# EasyEDA Pro project Nibunkatsu_One_Rev1_Project.epro, board PCB1
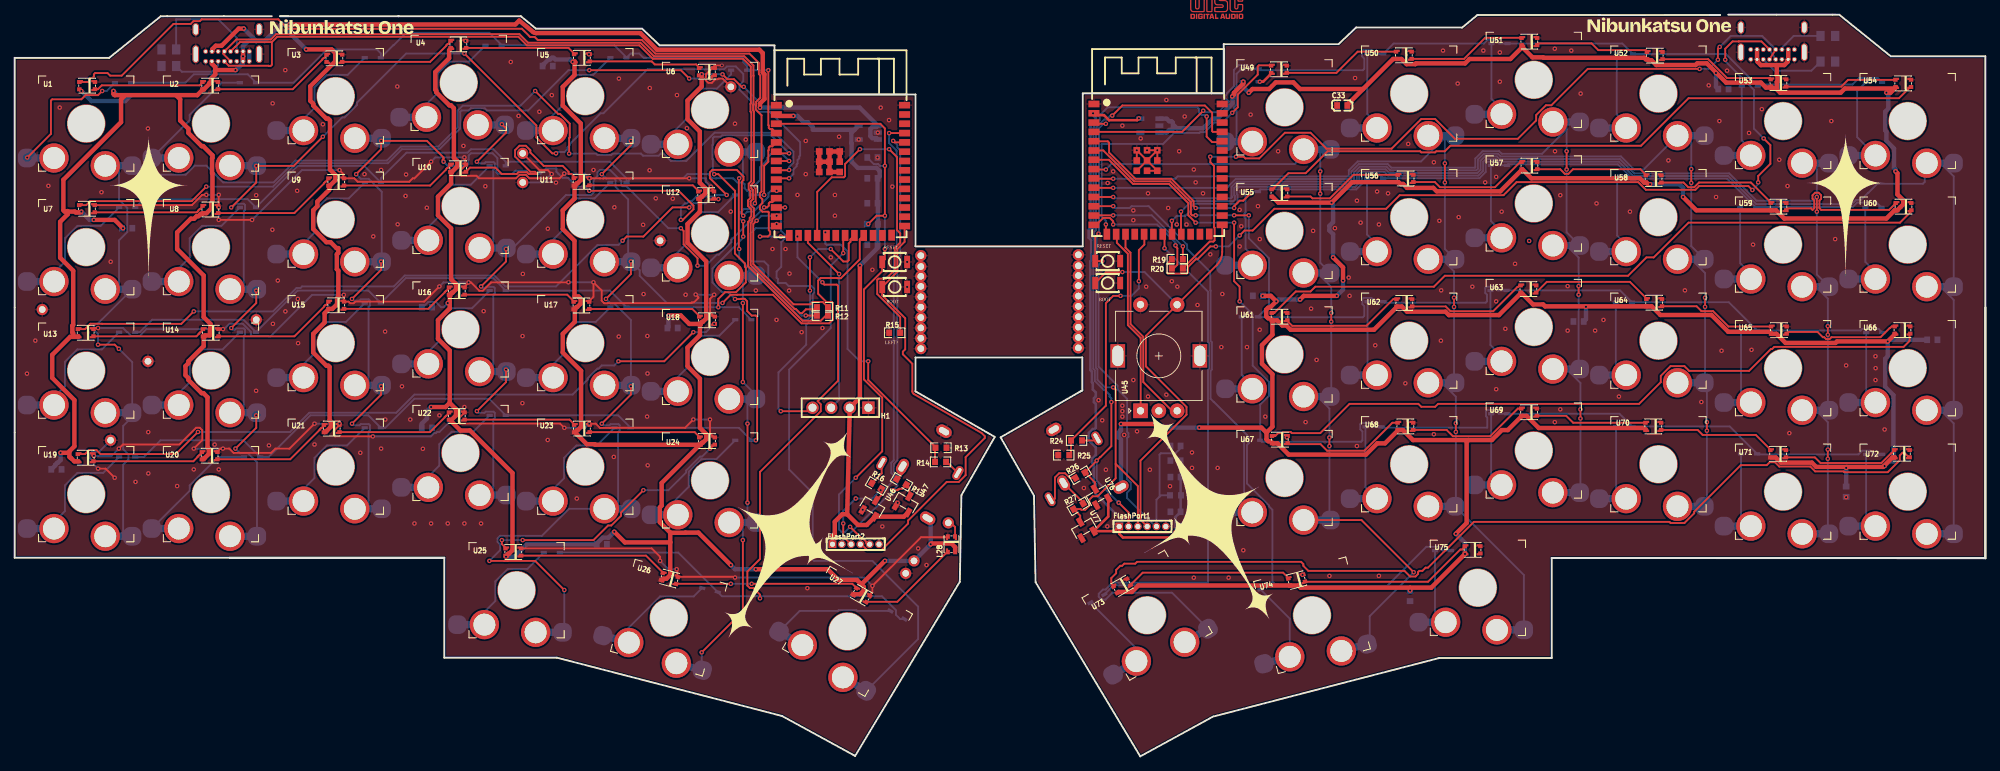
[diagram p1: board, top side]
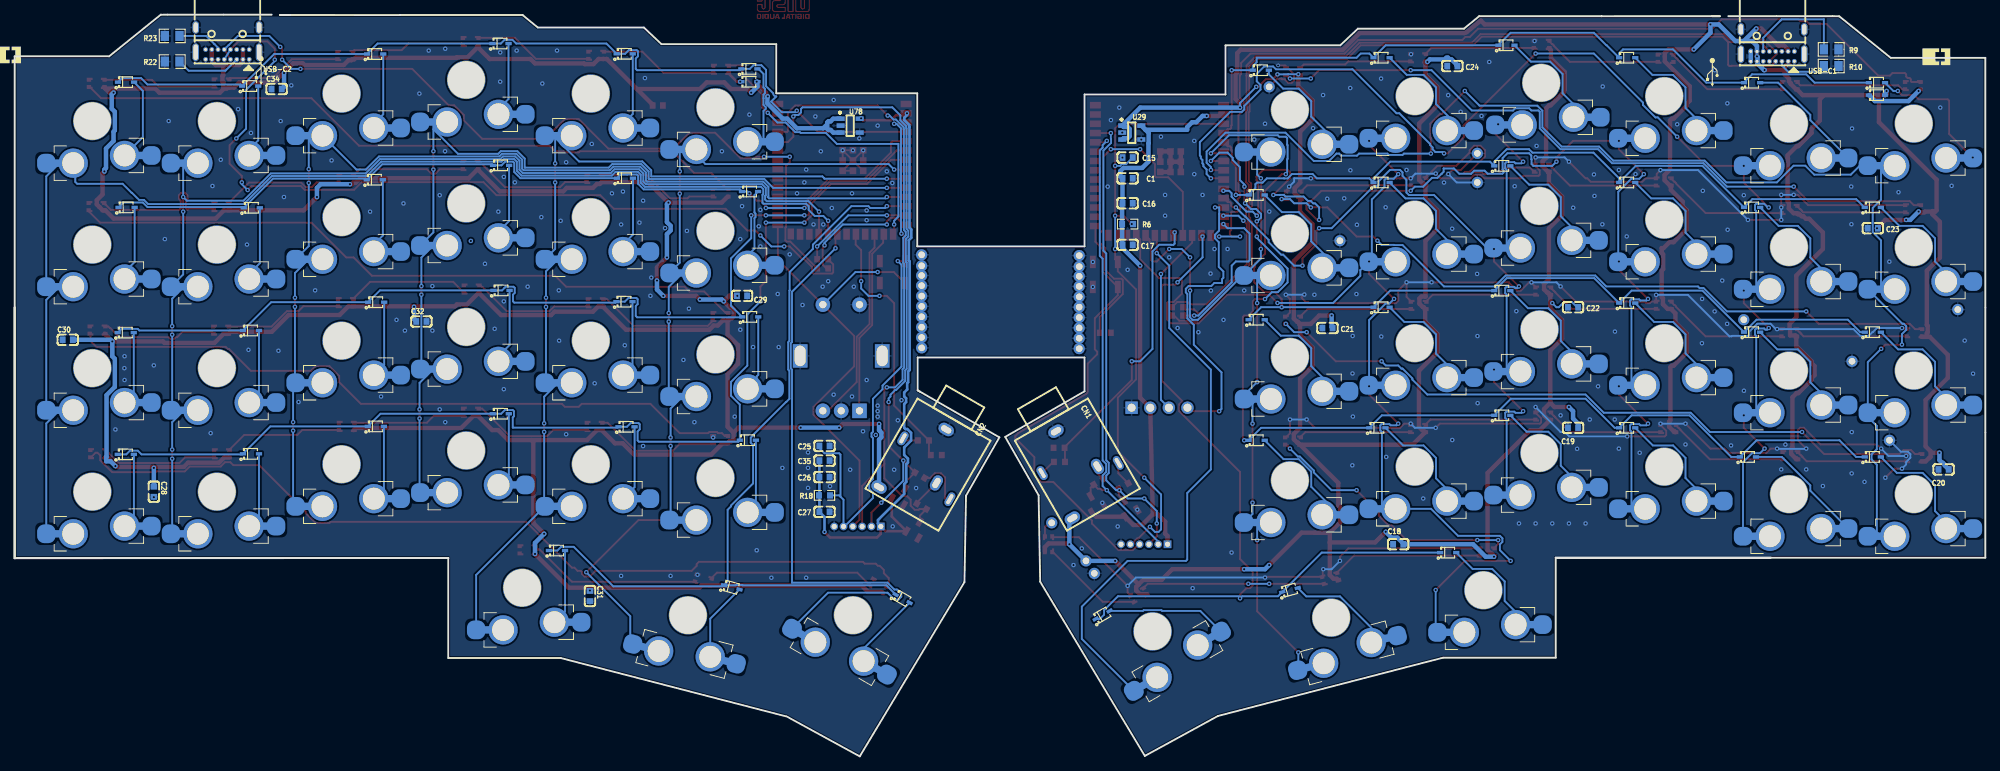
[diagram p2: board, bottom side, seen from below]

Outline 268.87 x 101.31 mm; copper layers: Top Layer, Bottom Layer. Coordinates in mm from the lower left corner of the outline.
Outline path: 58.62,27.13 0,27.13 0,95.41 12.9,95.41 19.93,101.08 20.83,101.1 35.07,101.1 ; 58.62,27.13 29.31,27.13 58.62,27.13 ; 58.62,27.13 58.62,13.48 73.98,13.48 104.7,5.51 114.67,0.06 128.95,23.86 129.17,35.67 133.72,43.63 122.9,49.86 122.9,54.48 145.67,54.48 145.67,50 ; 37.34,101.1 36.21,101.1 52.36,101.09 52.36,101.1 69.05,101.1 71.13,99.39 85.6,99.39 88.01,97.11 103.67,97.11 103.67,90.4 122.9,90.4 122.9,69.66 145.73,69.66 145.73,90.56 164.96,90.56 164.96,97.28 180.62,97.28 183.02,99.55 197.49,99.55 199.57,101.26 216.27,101.26 216.27,101.25 231.51,101.26 ; 145.67,50 134.52,43.57 139.07,35.61 139.29,23.8 153.57,0 163.54,5.45 ; 145.67,50 145.34,49.8 ; 163.63,5.47 194.35,13.43 209.71,13.43 209.71,27.09 ; 209.71,27.09 239.02,27.09 209.71,27.09 ; 209.71,27.09 268.33,27.09 ; 209.71,27.09 268.33,27.09 ; 209.71,27.09 268.87,27.07 ; 268.33,27.09 268.87,27.07 ; 231.28,101.26 231.51,101.26 ; 231.51,101.26 232.68,101.26 232.42,101.26 231.51,101.26 ; 233.8,101.31 248.04,101.31 248.94,101.3 255.97,95.62 268.87,95.62 268.87,27.07 ; 268.87,27.07 268.87,61.34 268.87,27.07
Stack: Top Layer 0.035mm / Dielectric1 1.51mm FR4 er 4.5 / Bottom Layer 0.035mm

## Design rules (mm)
template: JLCPCB Capability(Two Layers Board)
spacing copperThickness1oz (default): track to track 0.102, other pairs 0.152 to 0.3
spacing copperThickness2oz: track to track 0.203, other pairs 0.152 to 0.3
track width copperThickness1oz (default): min 0.127, default 0.254, max 2.54
track width copperThickness2oz: min 0.203, default 0.254, max 2.54
differential pair differentialPair (default): width min 0.127, default 0.254, max 2.54; gap min 0.152, default 0.152
via viaSize (default): diameter min 0.5, default 0.61, max 10; hole min 0.3, default 0.305, max 6.3

## Placement (name value [footprint] x y rotation side)
C1  1nF  [C0603]  117.02 78.95 180 bottom
C15  1uF  [C0603]  117.02 81.79 180 bottom
C16  0.1uF  [C0603]  117.02 75.55 180 bottom
C17  22uF  [C0603]  117.02 69.87 180 bottom
C18  10uF  [C0603]  80.1 28.97 0 bottom
C19  100nF  [C0603]  56.25 44.87 180 bottom
C20  100nF  [C0603]  5.7 39.19 180 bottom
C21  100nF  [C0603]  89.76 58.51 0 bottom
C22  100nF  [C0603]  56.25 61.35 0 bottom
C23  100nF  [C0603]  15.35 72.14 180 bottom
C24  10uF  [C0603]  72.72 94.29 180 bottom
C25  1uF  [C0603]  158.38 42.4 0 bottom
C26  0.1uF  [C0603]  158.38 38.15 180 bottom
C27  22uF  [C0603]  158.38 33.4 180 bottom
C28  10uF  [C0603]  249.88 36.15 270 bottom
C29  100nF  [C0603]  169.63 62.9 0 bottom
C30  100nF  [C0603]  261.63 56.9 180 bottom
C31  100nF  [C0603]  190.38 21.9 270 bottom
C32  100nF  [C0603]  213.38 59.4 180 bottom
C33  100nF  [C0603]  181.13 88.9 0 top
C34  10uF  [C0603]  233.13 91.15 180 bottom
C35  1nF  [C0603]  158.38 40.4 180 bottom
CN1  PJ-324M  [AUDIO-TH_PJ-324M#2]  123.64 39.65 240 bottom
CN2  PJ-324M  [AUDIO-TH_PJ-324M]  144.32 39.54 300 bottom
D1  1N4148WS  [SOD-323_L1.7-W1.3-LS2.7-RD]  14.78 92.02 180 bottom
D2  1N4148WS  [SOD-323_L1.7-W1.3-LS2.7-RD]  31.82 92.02 180 bottom
D3  1N4148WS  [SOD-323_L1.7-W1.3-LS2.7-RD]  48.86 95.43 180 bottom
D4  1N4148WS  [SOD-323_L1.7-W1.3-LS2.7-RD]  65.34 97.13 180 bottom
D5  1N4148WS  [SOD-323_L1.7-W1.3-LS2.7-RD]  82.38 95.43 180 bottom
D6  1N4148WS  [SOD-323_L1.7-W1.3-LS2.7-RD]  98.85 93.72 180 bottom
D7  1N4148WS  [SOD-323_L1.7-W1.3-LS2.7-RD]  15.35 74.98 180 bottom
D8  1N4148WS  [SOD-323_L1.7-W1.3-LS2.7-RD]  31.82 74.98 180 bottom
D9  1N4148WS  [SOD-323_L1.7-W1.3-LS2.7-RD]  48.86 78.39 180 bottom
D10  1N4148WS  [SOD-323_L1.7-W1.3-LS2.7-RD]  65.9 80.66 180 bottom
D11  1N4148WS  [SOD-323_L1.7-W1.3-LS2.7-RD]  82.38 78.39 180 bottom
D12  1N4148WS  [SOD-323_L1.7-W1.3-LS2.7-RD]  99.42 76.68 180 bottom
D13  1N4148WS  [SOD-323_L1.7-W1.3-LS2.7-RD]  15.35 57.94 180 bottom
D14  1N4148WS  [SOD-323_L1.7-W1.3-LS2.7-RD]  31.82 57.94 180 bottom
D15  1N4148WS  [SOD-323_L1.7-W1.3-LS2.7-RD]  48.86 61.91 180 bottom
D16  1N4148WS  [SOD-323_L1.7-W1.3-LS2.7-RD]  65.9 63.62 180 bottom
D17  1N4148WS  [SOD-323_L1.7-W1.3-LS2.7-RD]  82.38 61.35 180 bottom
D18  1N4148WS  [SOD-323_L1.7-W1.3-LS2.7-RD]  99.42 59.64 180 bottom
D19  1N4148WS  [SOD-323_L1.7-W1.3-LS2.7-RD]  15.35 40.9 180 bottom
D20  1N4148WS  [SOD-323_L1.7-W1.3-LS2.7-RD]  32.39 40.9 180 bottom
D21  1N4148WS  [SOD-323_L1.7-W1.3-LS2.7-RD]  48.86 44.87 180 bottom
D22  1N4148WS  [SOD-323_L1.7-W1.3-LS2.7-RD]  65.9 46.58 180 bottom
D23  1N4148WS  [SOD-323_L1.7-W1.3-LS2.7-RD]  82.94 44.87 180 bottom
D24  1N4148WS  [SOD-323_L1.7-W1.3-LS2.7-RD]  99.42 43.17 180 bottom
D25  1N4148WS  [SOD-323_L1.7-W1.3-LS2.7-RD]  73.29 27.83 180 bottom
D26  1N4148WS  [SOD-323_L1.7-W1.3-LS2.7-RD]  94.87 22.72 165 bottom
D27  1N4148WS  [SOD-323_L1.7-W1.3-LS2.7-RD]  120.43 19.31 150 bottom
D28  1N4148WS  [SOD-323_L1.7-W1.3-LS2.7-RD]  14.78 90.31 180 bottom
D29  1N4148WS  [SOD-323_L1.7-W1.3-LS2.7-RD]  168.63 93.9 180 bottom
D30  1N4148WS  [SOD-323_L1.7-W1.3-LS2.7-RD]  185.63 95.96 180 bottom
D31  1N4148WS  [SOD-323_L1.7-W1.3-LS2.7-RD]  202.59 97.36 180 bottom
D32  1N4148WS  [SOD-323_L1.7-W1.3-LS2.7-RD]  219.68 95.93 180 bottom
D33  1N4148WS  [SOD-323_L1.7-W1.3-LS2.7-RD]  236.74 91.55 180 bottom
D34  1N4148WS  [SOD-323_L1.7-W1.3-LS2.7-RD]  253.68 92.09 180 bottom
D35  1N4148WS  [SOD-323_L1.7-W1.3-LS2.7-RD]  168.54 77.15 180 bottom
D36  1N4148WS  [SOD-323_L1.7-W1.3-LS2.7-RD]  185.61 78.97 180 bottom
D37  1N4148WS  [SOD-323_L1.7-W1.3-LS2.7-RD]  202.51 80.72 180 bottom
D38  1N4148WS  [SOD-323_L1.7-W1.3-LS2.7-RD]  219.73 78.76 180 bottom
D39  1N4148WS  [SOD-323_L1.7-W1.3-LS2.7-RD]  236.52 74.93 180 bottom
D40  1N4148WS  [SOD-323_L1.7-W1.3-LS2.7-RD]  253.6 74.98 180 bottom
D41  1N4148WS  [SOD-323_L1.7-W1.3-LS2.7-RD]  168.51 60.03 180 bottom
D42  1N4148WS  [SOD-323_L1.7-W1.3-LS2.7-RD]  185.67 62.11 180 bottom
D43  1N4148WS  [SOD-323_L1.7-W1.3-LS2.7-RD]  202.44 63.64 180 bottom
D44  1N4148WS  [SOD-323_L1.7-W1.3-LS2.7-RD]  219.55 62.03 180 bottom
D45  1N4148WS  [SOD-323_L1.7-W1.3-LS2.7-RD]  236.63 58.17 180 bottom
D46  1N4148WS  [SOD-323_L1.7-W1.3-LS2.7-RD]  253.71 57.88 180 bottom
D47  1N4148WS  [SOD-323_L1.7-W1.3-LS2.7-RD]  168.84 43.18 180 bottom
D48  1N4148WS  [SOD-323_L1.7-W1.3-LS2.7-RD]  185.39 45.01 180 bottom
D49  1N4148WS  [SOD-323_L1.7-W1.3-LS2.7-RD]  202.55 46.79 180 bottom
D50  1N4148WS  [SOD-323_L1.7-W1.3-LS2.7-RD]  219.59 45.07 180 bottom
D51  1N4148WS  [SOD-323_L1.7-W1.3-LS2.7-RD]  236.63 41.32 180 bottom
D52  1N4148WS  [SOD-323_L1.7-W1.3-LS2.7-RD]  253.7 41.24 180 bottom
D53  1N4148WS  [SOD-323_L1.7-W1.3-LS2.7-RD]  147.71 21.55 210 bottom
D54  1N4148WS  [SOD-323_L1.7-W1.3-LS2.7-RD]  171.04 23.08 195 bottom
D55  1N4148WS  [SOD-323_L1.7-W1.3-LS2.7-RD]  194.88 28.11 180 bottom
D56  1N4148WS  [SOD-323_L1.7-W1.3-LS2.7-RD]  168.63 92.15 180 bottom
FlashPort1  HX PZ1.27-1x6P WZ  [HDR-TH_6P_HXPZ1.27-1X6PWZ]  153.88 31.4 0 top
FlashPort2  HX PZ1.27-1x6P WZ  [HDR-TH_6P_HXPZ1.27-1X6PWZ]  114.75 28.97 0 top
H1  2.54-1*4P母  [HDR-TH_4P-P2.54-V-F]  112.67 47.62 180 top
L1  WS2812C-2020  [LED-SMD_L2.2-W2.0]  9.89 91.61 0 top
L2  WS2812C-2020  [LED-SMD_L2.2-W2.0]  26.68 91.61 0 top
L3  WS2812C-2020  [LED-SMD_L2.2-W2.0]  43.62 95.34 0 top
L4  WS2812C-2020  [LED-SMD_L2.2-W2.0]  60.54 97.25 0 top
L5  WS2812C-2020  [LED-SMD_L2.2-W2.0]  77.39 95.41 0 top
L6  WS2812C-2020  [LED-SMD_L2.2-W2.0]  94.45 93.51 0 top
L7  WS2812C-2020  [LED-SMD_L2.2-W2.0]  9.86 74.79 0 top
L8  WS2812C-2020  [LED-SMD_L2.2-W2.0]  26.7 74.69 0 top
L9  WS2812C-2020  [LED-SMD_L2.2-W2.0]  43.87 78.45 0 top
L10  WS2812C-2020  [LED-SMD_L2.2-W2.0]  60.51 80.33 0 top
L11  WS2812C-2020  [LED-SMD_L2.2-W2.0]  77.35 78.48 0 top
L12  WS2812C-2020  [LED-SMD_L2.2-W2.0]  94.34 76.65 0 top
L13  WS2812C-2020  [LED-SMD_L2.2-W2.0]  9.69 57.86 0 top
L14  WS2812C-2020  [LED-SMD_L2.2-W2.0]  26.75 57.86 0 top
L15  WS2812C-2020  [LED-SMD_L2.2-W2.0]  43.87 61.61 0 top
L16  WS2812C-2020  [LED-SMD_L2.2-W2.0]  60.32 63.55 0 top
L17  WS2812C-2020  [LED-SMD_L2.2-W2.0]  77.33 61.59 0 top
L18  WS2812C-2020  [LED-SMD_L2.2-W2.0]  94.46 59.56 0 top
L19  WS2812C-2020  [LED-SMD_L2.2-W2.0]  9.69 40.79 0 top
L20  WS2812C-2020  [LED-SMD_L2.2-W2.0]  26.6 41.06 0 top
L21  WS2812C-2020  [LED-SMD_L2.2-W2.0]  43.25 44.77 0 top
L22  WS2812C-2020  [LED-SMD_L2.2-W2.0]  60.32 46.48 0 top
L23  WS2812C-2020  [LED-SMD_L2.2-W2.0]  77.39 44.77 0 top
L24  WS2812C-2020  [LED-SMD_L2.2-W2.0]  94.46 43.06 0 top
L25  WS2812C-2020  [LED-SMD_L2.2-W2.0]  68.03 27.9 0 top
L26  WS2812C-2020  [LED-SMD_L2.2-W2.0]  89.34 24.29 345 top
L27  WS2812C-2020  [LED-SMD_L2.2-W2.0]  115.51 22.01 330 top
L28  WS2812C-2020  [LED-SMD_L2.2-W2.0]  127.82 28.97 90 top
L29  WS2812C-2020  [LED-SMD_L2.2-W2.0]  172.49 93.84 0 top
L30  WS2812C-2020  [LED-SMD_L2.2-W2.0]  189.53 95.75 0 top
L31  WS2812C-2020  [LED-SMD_L2.2-W2.0]  206.66 97.62 0 top
L32  WS2812C-2020  [LED-SMD_L2.2-W2.0]  223.76 95.71 0 top
L33  WS2812C-2020  [LED-SMD_L2.2-W2.0]  240.64 91.97 0 top
L34  WS2812C-2020  [LED-SMD_L2.2-W2.0]  257.67 91.92 0 top
L35  WS2812C-2020  [LED-SMD_L2.2-W2.0]  172.56 76.95 0 top
L36  WS2812C-2020  [LED-SMD_L2.2-W2.0]  189.77 78.93 0 top
L37  WS2812C-2020  [LED-SMD_L2.2-W2.0]  206.67 80.68 0 top
L38  WS2812C-2020  [LED-SMD_L2.2-W2.0]  223.61 78.86 0 top
L39  WS2812C-2020  [LED-SMD_L2.2-W2.0]  240.65 75.08 0 top
L40  WS2812C-2020  [LED-SMD_L2.2-W2.0]  257.7 75.08 0 top
L41  WS2812C-2020  [LED-SMD_L2.2-W2.0]  172.57 60.05 0 top
L42  WS2812C-2020  [LED-SMD_L2.2-W2.0]  189.6 61.94 0 top
L43  WS2812C-2020  [LED-SMD_L2.2-W2.0]  206.53 63.82 0 top
L44  WS2812C-2020  [LED-SMD_L2.2-W2.0]  223.68 61.97 0 top
L45  WS2812C-2020  [LED-SMD_L2.2-W2.0]  240.7 58.21 0 top
L46  WS2812C-2020  [LED-SMD_L2.2-W2.0]  257.56 58.22 0 top
L47  WS2812C-2020  [LED-SMD_L2.2-W2.0]  172.61 43.26 0 top
L48  WS2812C-2020  [LED-SMD_L2.2-W2.0]  189.74 45.07 0 top
L49  WS2812C-2020  [LED-SMD_L2.2-W2.0]  206.62 47 0 top
L50  WS2812C-2020  [LED-SMD_L2.2-W2.0]  223.57 45.07 0 top
L51  WS2812C-2020  [LED-SMD_L2.2-W2.0]  240.6 41.32 0 top
L52  WS2812C-2020  [LED-SMD_L2.2-W2.0]  257.48 41.33 0 top
L53  WS2812C-2020  [LED-SMD_L2.2-W2.0]  151.08 23.28 30 top
L54  WS2812C-2020  [LED-SMD_L2.2-W2.0]  174.91 24.07 15 top
L55  WS2812C-2020  [LED-SMD_L2.2-W2.0]  198.91 28.2 0 top
NOREF  -  [Pad_e20794]  123.63 64.19 0 top
NOREF#2  -  [Pad_e21819]  145.13 60.04 0 top
NOREF#3  -  [Pad_e21814]  145.13 65.68 0 top
NOREF#4  -  [Pad_e21817]  145.13 61.47 0 top
NOREF#5  -  [Pad_e20797]  123.63 61.36 0 top
NOREF#6  -  [Pad_e21821]  145.13 55.79 0 top
NOREF#7  -  [Pad_e6608]  97.71 91.45 0 top
NOREF#8  -  [Pad_e20799]  123.63 58.52 0 top
NOREF#9  -  [Pad_e6609]  3.76 61.03 0 top
NOREF#10  -  [Pad_e20798]  123.63 59.94 0 top
NOREF#11  -  [Pad_e21815]  145.13 64.29 0 top
NOREF#12  -  [Pad_e21812]  145.13 68.5 0 top
NOREF#13  -  [Pad_e14164]  127.38 31.9 0 top
NOREF#14  -  [Pad_e21820]  145.13 57.22 0 top
NOREF#15  -  [Pad_e4008]  13.08 43.17 0 top
NOREF#16  -  [Pad_e7011]  32.96 59.64 0 top
NOREF#17  -  [Pad_e19134]  123.63 65.57 0 top
NOREF#18  -  [Pad_e4802]  18.19 53.96 0 top
NOREF#19  -  [Pad_e20806]  123.63 55.69 0 top
NOREF#20  -  [Pad_e5564]  88.06 70.43 0 top
NOREF#21  -  [Pad_e21816]  145.13 62.87 0 top
NOREF#22  -  [Pad_e20801]  123.63 57.11 0 top
NOREF#23  -  [Pad_e14163]  121.57 24.99 0 top
NOREF#24  -  [Pad_e5862]  69.31 82.36 0 top
NOREF#25  -  [Pad_e6602]  69.31 78.39 0 top
NOREF#26  -  [Pad_e19126]  123.63 68.4 0 top
NOREF#27  -  [Pad_e21813]  145.13 67 0 top
NOREF#28  -  [Pad_e14165]  122.7 26.7 0 top
NOREF#29  -  [Pad_e19133]  123.63 66.9 0 top
NOREF#30  -  [Pad_e21818]  145.13 58.62 0 top
NOREF#31  -  [Pad_e20795]  123.63 62.77 0 top
R6  10K  [R0603]  117.02 72.71 0 bottom
R9  5.1kΩ  [R0805]  21.03 96.56 180 bottom
R10  5.1kΩ  [R0805]  21.03 94.29 180 bottom
R11  0K  [R0603]  110.21 61.35 0 top
R12  0K  [R0603]  110.21 60.21 180 top
R13  10K  [R0603]  126.38 42.15 180 top
R14  5.1K  [R0603]  126.32 40.22 0 top
R15  0K  [R0603]  120.06 57.86 0 top
R16  22  [R0603]  117.59 36.92 330 top
R17  22  [R0603]  121 37.49 150 top
R18  10K  [R0603]  158.38 35.65 0 bottom
R19  0K  [R0603]  158.63 67.9 0 top
R20  0K  [R0603]  158.63 66.65 180 top
R22  5.1kΩ  [R0805]  247.38 94.9 0 bottom
R23  5.1kΩ  [R0805]  247.38 98.4 0 bottom
R24  5.1K  [R0603]  144.88 43.15 0 top
R25  10K  [R0603]  143.13 41.15 0 top
R26  22  [R0603]  145.38 38.4 30 top
R27  22  [R0603]  145.13 34.15 30 top
SW1  B3U-1000P  [KEY-SMD_B3U-1000PM]  120.06 67.53 0 top
SW2  B3U-1000P  [KEY-SMD_B3U-1000PM]  120.06 64.12 180 top
SW3  B3U-1000P  [KEY-SMD_B3U-1000PM]  149.13 67.65 0 top
SW4  B3U-1000P  [KEY-SMD_B3U-1000PM]  149.13 64.65 180 top
U1  -  [SW_Gateron_LowProfile_HotSwap_PTH1]  9.76 86.43 0 top
U2  -  [SW_Gateron_LowProfile_HotSwap_PTH1]  26.79 86.43 0 top
U3  -  [SW_Gateron_LowProfile_HotSwap_PTH1]  43.81 90.18 0 top
U4  -  [SW_Gateron_LowProfile_HotSwap_PTH1]  60.59 91.99 0 top
U5  -  [SW_Gateron_LowProfile_HotSwap_PTH1]  77.85 90.18 0 top
U6  -  [SW_Gateron_LowProfile_HotSwap_PTH1]  94.88 88.3 0 top
U7  -  [SW_Gateron_LowProfile_HotSwap_PTH1]  9.76 69.56 0 top
U8  -  [SW_Gateron_LowProfile_HotSwap_PTH1]  26.79 69.56 0 top
U9  -  [SW_Gateron_LowProfile_HotSwap_PTH1]  43.81 73.3 0 top
U10  -  [SW_Gateron_LowProfile_HotSwap_PTH1]  60.83 75.18 0 top
U11  -  [SW_Gateron_LowProfile_HotSwap_PTH1]  77.85 73.3 0 top
U12  -  [SW_Gateron_LowProfile_HotSwap_PTH1]  94.88 71.43 0 top
U13  -  [SW_Gateron_LowProfile_HotSwap_PTH1]  9.76 52.69 0 top
U14  -  [SW_Gateron_LowProfile_HotSwap_PTH1]  26.79 52.69 0 top
U15  -  [SW_Gateron_LowProfile_HotSwap_PTH1]  43.81 56.43 0 top
U16  -  [SW_Gateron_LowProfile_HotSwap_PTH1]  60.83 58.31 0 top
U17  -  [SW_Gateron_LowProfile_HotSwap_PTH1]  77.85 56.43 0 top
U18  -  [SW_Gateron_LowProfile_HotSwap_PTH1]  94.88 54.56 0 top
U19  -  [SW_Gateron_LowProfile_HotSwap_PTH1]  9.76 35.81 0 top
U20  -  [SW_Gateron_LowProfile_HotSwap_PTH1]  26.79 35.81 0 top
U21  -  [SW_Gateron_LowProfile_HotSwap_PTH1]  43.81 39.56 0 top
U22  -  [SW_Gateron_LowProfile_HotSwap_PTH1]  60.83 41.44 0 top
U23  -  [SW_Gateron_LowProfile_HotSwap_PTH1]  77.85 39.56 0 top
U24  -  [SW_Gateron_LowProfile_HotSwap_PTH1]  94.88 37.69 0 top
U25  -  [SW_Gateron_LowProfile_HotSwap_PTH1]  68.48 22.69 0 top
U26  -  [SW_Gateron_LowProfile_HotSwap_PTH1#2]  89.25 18.94 345 top
U27  -  [SW_Gateron_LowProfile_HotSwap_PTH1]  113.62 17.07 330 top
U29  AP2112K-3.3TRG1  [SOT-25-5_L2.9-W1.6-P0.95-LS2.8-BL]  116.46 85.2 270 bottom
U30  ESP32-S3-WROOM-1-N4R2  [WIRELM-SMD_ESP32-S3-WROOM-1]  112.67 80.05 0 top
U45  -  [RotaryEncoder_Alps_EC11E-Switch_Vertical_H20mm]  153.6 47.2 90 top
U46  BAT54S  [SOT-23-3_L2.9-W1.3-P1.90-LS2.4-BR]  117.02 34.08 240 top
U47  BAT54S  [SOT-23-3_L2.9-W1.3-P1.90-LS2.4-BR]  121.57 34.65 240 top
U48  ESP32-S3-WROOM-1-N4R2  [WIRELM-SMD_ESP32-S3-WROOM-1]  156 80.21 0 top
U49  -  [SW_Gateron_LowProfile_HotSwap_PTH1]  173.25 88.65 0 top
U50  -  [SW_Gateron_LowProfile_HotSwap_PTH1]  190.26 90.52 0 top
U51  -  [SW_Gateron_LowProfile_HotSwap_PTH1]  207.26 92.4 0 top
U52  -  [SW_Gateron_LowProfile_HotSwap_PTH1]  224.27 90.52 0 top
U53  -  [SW_Gateron_LowProfile_HotSwap_PTH1]  241.27 86.77 0 top
U54  -  [SW_Gateron_LowProfile_HotSwap_PTH1]  258.28 86.77 0 top
U55  -  [SW_Gateron_LowProfile_HotSwap_PTH1]  173.25 71.77 0 top
U56  -  [SW_Gateron_LowProfile_HotSwap_PTH1]  190.26 73.65 0 top
U57  -  [SW_Gateron_LowProfile_HotSwap_PTH1]  207.26 75.52 0 top
U58  -  [SW_Gateron_LowProfile_HotSwap_PTH1]  224.27 73.65 0 top
U59  -  [SW_Gateron_LowProfile_HotSwap_PTH1]  241.27 69.9 0 top
U60  -  [SW_Gateron_LowProfile_HotSwap_PTH1]  258.28 69.9 0 top
U61  -  [SW_Gateron_LowProfile_HotSwap_PTH1]  173.25 54.9 0 top
U62  -  [SW_Gateron_LowProfile_HotSwap_PTH1]  190.26 56.77 0 top
U63  -  [SW_Gateron_LowProfile_HotSwap_PTH1]  207.26 58.65 0 top
U64  -  [SW_Gateron_LowProfile_HotSwap_PTH1]  224.27 56.77 0 top
U65  -  [SW_Gateron_LowProfile_HotSwap_PTH1]  241.27 53.02 0 top
U66  -  [SW_Gateron_LowProfile_HotSwap_PTH1]  258.28 53.02 0 top
U67  -  [SW_Gateron_LowProfile_HotSwap_PTH1]  173.25 38.02 0 top
U68  -  [SW_Gateron_LowProfile_HotSwap_PTH1]  190.26 39.9 0 top
U69  -  [SW_Gateron_LowProfile_HotSwap_PTH1]  207.26 41.77 0 top
U70  -  [SW_Gateron_LowProfile_HotSwap_PTH1]  224.27 39.9 0 top
U71  -  [SW_Gateron_LowProfile_HotSwap_PTH1]  241.27 36.15 0 top
U72  -  [SW_Gateron_LowProfile_HotSwap_PTH1]  258.28 36.15 0 top
U73  -  [SW_Gateron_LowProfile_HotSwap_PTH1]  154.5 19.27 30 top
U74  -  [SW_Gateron_LowProfile_HotSwap_PTH1]  177 19.27 15 top
U75  -  [SW_Gateron_LowProfile_HotSwap_PTH1]  199.63 23.02 0 top
U76  BAT54S  [SOT-23-3_L2.9-W1.3-P1.90-LS2.4-BR]  147.88 35.65 300 top
U77  BAT54S  [SOT-23-3_L2.9-W1.3-P1.90-LS2.4-BR]  145.88 31.15 300 top
U78  AP2112K-3.3TRG1  [SOT-25-5_L2.9-W1.6-P0.95-LS2.8-BL]  154.88 86.15 270 bottom
USB-C1  USB4085-GF-A  [USC-C-SMD_USB4085-GF-A]  29.03 97.11 0 bottom
USB-C2  USB4085-GF-A  [USC-C-SMD_USB4085-GF-A]  239.84 97.38 0 bottom

## Footprints (pads in the part's own frame, mm; a bottom-side part is the same pattern mirrored in y, then rotated)
AUDIO-TH_PJ-324M
  oval 1.5x2.2 hole 0.8x1.5: 1(-5.7,-0.35) 4(5.7,-4.35)
  oval 2x1 hole 1.5x0.5: 2(2.3,4.85)
  oval 2.2x1.4 hole 1.5x0.8: 3(1.3,2.15)
  oval 2x1.1 hole 1.5x0.5: 5(-1.7,-4.85)
AUDIO-TH_PJ-324M#2
  oval 1.5x2.2 hole 0.8x1.5: 1(-5.7,-0.35) 4(5.7,-4.35)
  oval 2x1 hole 1.5x0.5: 2(2.3,4.85)
  oval 2.2x1.4 hole 1.5x0.8: 3(1.3,2.15)
  oval 2x1.1 hole 1.5x0.5: 5(-1.7,-4.85)
C0603
  rect 0.8x0.9 smd: 1(-0.7,0) 2(0.7,0)
HDR-TH_4P-P2.54-V-F
  rect 1.7x1.7 hole 1.1: 1(-3.81,0)
  round 1.7 hole 1.1: 2(-1.27,0) 3(1.27,0) 4(3.81,0)
HDR-TH_6P_HXPZ1.27-1X6PWZ
  rect 1.05x1.05 hole 0.7: 1(-3.175,0)
  round 1.05 hole 0.7: 2(-1.905,0) 3(-0.635,0) 4(0.635,0) 5(1.905,0) 6(3.175,0)
KEY-SMD_B3U-1000PM
  rect 0.8x1.7 smd: 1(-1.7,0) 2(1.7,0)
LED-SMD_L2.2-W2.0
  custom 0.8x0.536 smd: 1(0.965,-0.485) 3(-0.966,0.5)
  custom 0.802x0.535 smd: 2(0.965,0.5)
  custom 0.8x0.535 smd: 4(-0.966,-0.5)
Pad_e4008
  round 1.524 hole 0.914: 6(0,0)
Pad_e4802
  round 1.524 hole 0.914: 1(0,0)
Pad_e5564
  round 1.524 hole 0.914: 3(0,0)
Pad_e5862
  round 1.524 hole 0.914: 1(0,0)
Pad_e6602
  round 1.524 hole 0.914: 3(0,0)
Pad_e6608
  round 1.524 hole 0.914: 9(0,0)
Pad_e6609
  round 1.524 hole 0.914: 10(0,0)
Pad_e7011
  round 1.524 hole 0.914: 3(0,0)
Pad_e14163
  round 1.524 hole 0.914: 8(0,0)
Pad_e14164
  round 1.524 hole 0.914: 8(0,0)
Pad_e14165
  round 1.524 hole 0.914: 8(0,0)
Pad_e19126
  round 1.524 hole 0.914: 8(0,0)
Pad_e19133
  round 1.524 hole 0.914: 8(0,0)
Pad_e19134
  round 1.524 hole 0.914: 8(0,0)
Pad_e20794
  round 1.524 hole 0.914: 8(0,0)
Pad_e20795
  round 1.524 hole 0.914: 8(0,0)
Pad_e20797
  round 1.524 hole 0.914: 8(0,0)
Pad_e20798
  round 1.524 hole 0.914: 8(0,0)
Pad_e20799
  round 1.524 hole 0.914: 8(0,0)
Pad_e20801
  round 1.524 hole 0.914: 8(0,0)
Pad_e20806
  round 1.524 hole 0.914: 8(0,0)
Pad_e21812
  round 1.524 hole 0.914: 8(0,0)
Pad_e21813
  round 1.524 hole 0.914: 8(0,0)
Pad_e21814
  round 1.524 hole 0.914: 8(0,0)
Pad_e21815
  round 1.524 hole 0.914: 8(0,0)
Pad_e21816
  round 1.524 hole 0.914: 8(0,0)
Pad_e21817
  round 1.524 hole 0.914: 8(0,0)
Pad_e21818
  round 1.524 hole 0.914: 8(0,0)
Pad_e21819
  round 1.524 hole 0.914: 8(0,0)
Pad_e21820
  round 1.524 hole 0.914: 8(0,0)
Pad_e21821
  round 1.524 hole 0.914: 8(0,0)
R0603
  rect 0.806x0.864 smd: 1(-0.753,0) 2(0.753,0)
R0805
  rect 1.133x1.377 smd: 1(-1,0) 2(1,0)
RotaryEncoder_Alps_EC11E-Switch_Vertical_H20mm
  rect 2x2 hole 1: A(0,0)
  round 2 hole 1: B(0,-5) C(0,-2.5) S1(14.5,-5) S2(14.5,0)
  rect 3.2x2 hole 2.8x1.5: MT1(7.5,3.1) MT2(7.5,-8.1)
SOD-323_L1.7-W1.3-LS2.7-RD
  rect 0.845x0.455 smd: 1(-1.097,0) 2(1.097,0)
SOT-23-3_L2.9-W1.3-P1.90-LS2.4-BR
  rect 1.25x0.7 smd: 1(1,-0.95) 2(1,0.95) 3(-1,0)
SOT-25-5_L2.9-W1.6-P0.95-LS2.8-BL
  rect 0.623x1.105 smd: 1(-0.95,-1.3) 2(-0.001,-1.3) 3(0.95,-1.3) 4(0.95,1.3) 5(-0.95,1.3)
SW_Gateron_LowProfile_HotSwap_PTH1
  round 5.25 hole 5.08: (0,0)
  rrect 2.5x2.55 smd far side: 1(-8.075,-4.7) 2(6.275,-5.75)
  rect 3.9x1 smd far side: 1(-6.35,-4.7)
  round 4 hole 3: 1(-4.4,-4.7) 2(2.6,-5.75)
  rect 3.75x1 smd far side: 2(4.475,-5.75)
SW_Gateron_LowProfile_HotSwap_PTH1#2
  round 5.25 hole 5.08: (0,0)
  rrect 2.5x2.55 smd far side: 1(-8.075,-4.7) 2(6.275,-5.75)
  rect 3.9x1 smd far side: 1(-6.35,-4.7)
  round 4 hole 3: 1(-4.4,-4.7) 2(2.6,-5.75)
  rect 3.75x1 smd far side: 2(4.475,-5.75)
USC-C-SMD_USB4085-GF-A
  round 0.65 hole 0.4: A1(-2.975,2.18) A4(-2.125,2.18) A5(-1.275,2.18) A6(-0.425,2.18) A7(0.425,2.18) A8(1.275,2.18) A9(2.125,2.18) A12(2.975,2.18) B1(2.98,0.83) B4(2.13,0.83) B5(1.28,0.83) B6(0.43,0.83) B7(-0.42,0.83) B8(-1.27,0.83) B9(-2.12,0.83) B12(-2.975,0.83)
  oval 0.9x1.7 hole 0.6x1.4: S1(-4.325,-2.18) S1(4.325,-2.18)
  oval 0.9x2.4 hole 0.6x2.1: S1(-4.325,1.2) S1(4.325,1.2)
WIRELM-SMD_ESP32-S3-WROOM-1
  rect 1.5x0.9 smd: 1(-8.75,8.895) 2(-8.75,7.625) 3(-8.75,6.355) 4(-8.75,5.085) 5(-8.75,3.815) 6(-8.75,2.545) 7(-8.75,1.275) 8(-8.75,0.005) 9(-8.75,-1.265) 10(-8.75,-2.535) 11(-8.75,-3.805) 12(-8.75,-5.075) 13(-8.75,-6.345) 14(-8.75,-7.615) 27(8.75,-7.615) 28(8.75,-6.345) 29(8.75,-5.075) 30(8.75,-3.805) 31(8.75,-2.535) 32(8.75,-1.265) 33(8.75,0.005) 34(8.75,1.275) 35(8.75,2.545) 36(8.75,3.815) 37(8.75,5.085) 38(8.75,6.355) 39(8.75,7.625) 40(8.75,8.895)
  rect 0.9x1.5 smd: 15(-6.985,-8.895) 16(-5.715,-8.895) 17(-4.445,-8.895) 18(-3.175,-8.895) 19(-1.905,-8.895) 20(-0.635,-8.895) 21(0.635,-8.895) 22(1.905,-8.895) 23(3.175,-8.895) 24(4.445,-8.895) 25(5.715,-8.895) 26(6.985,-8.865)
  rect 0.9x0.9 smd: 41(-2.9,2.575) 41(-2.9,1.175) 41(-2.9,-0.225) 41(-1.5,2.575) 41(-1.5,1.175) 41(-1.5,-0.225) 41(-0.1,2.575) 41(-0.1,1.175) 41(-0.1,-0.225)

## Nets
As in the schematic, except:
GND: C1.2 C15.1 C16.2 C17.2 C18.2 C19.1 C20.1 C21.2 C22.2 C23.1 C24.1 C25.1 C26.2 C27.2 C28.2 C29.1 C30.1 C31.2 C32.2 C33.1 C34.1 C35.2 CN1.1 CN2.1 FlashPort1.6 FlashPort2.6 H1.1 L1.2 L2.2 L3.2 L4.2 L5.2 L6.2 L7.2 L8.2 L9.2 L10.2 L11.2 L12.2 L13.2 L14.2 L15.2 L16.2 L17.2 L18.2 L19.2 L20.2 L21.2 L22.2 L23.2 L24.2 L25.2 L26.2 L27.2 L28.2 L29.2 L30.2 L31.2 L32.2 L33.2 L34.2 L35.2 L36.2 L37.2 L38.2 L39.2 L40.2 L41.2 L42.2 L43.2 L44.2 L45.2 L46.2 L47.2 L48.2 L49.2 L50.2 L51.2 L52.2 L53.2 L54.2 L55.2 NOREF.8 NOREF#2.8 NOREF#3.8 NOREF#4.8 NOREF#5.8 NOREF#6.8 NOREF#7.9 NOREF#8.8 NOREF#9.10 NOREF#10.8 NOREF#11.8 NOREF#12.8 NOREF#14.8 NOREF#15.6 NOREF#16.3 NOREF#17.8 NOREF#18.1 NOREF#19.8 NOREF#20.3 NOREF#21.8 NOREF#22.8 NOREF#23.8 NOREF#24.1 NOREF#25.3 NOREF#26.8 NOREF#27.8 NOREF#29.8 NOREF#30.8 NOREF#31.8 R9.2 R10.2 R13.1 R15.1 R22.2 R23.2 R25.1 SW1.2 SW2.1 SW3.2 SW4.1 U29.2 U29.4 U30.1 U30.40 U30.41 U45.C U45.MT1 U45.MT2 U45.S2 U46.1 U47.1 U48.1 U48.40 U48.41 U76.1 U77.1 U78.2 U78.4 USB-C1.A1 USB-C1.A12 USB-C1.B1 USB-C1.B12 USB-C1.S1 USB-C2.A1 USB-C2.A12 USB-C2.B1 USB-C2.B12 USB-C2.S1
VBUS: C18.1 C19.2 C20.2 C21.1 C22.1 C23.2 C24.2 CN1.4 D28.2 L2.4 L3.4 L4.4 L5.4 L6.4 L7.4 L8.4 L9.4 L10.4 L11.4 L12.4 L13.4 L14.4 L15.4 L16.4 L17.4 L18.4 L19.4 L20.4 L21.4 L22.4 L23.4 L24.4 L25.4 L26.4 L27.4 L28.4 NOREF#28.8 U29.1 U29.3 USB-C1.A4 USB-C1.A9 USB-C1.B4 USB-C1.B9

Pads without a net: L28 1; L55 1; NOREF#13 8; U30 20 24 25 26 28 29 30 31 32 33 34 35 38 39; U48 18 20 24 25 26 28 29 30 31 32 33 34 35 38 39; USB-C1 A8 B8; USB-C2 A8 B8

## Via types
v1: diameter 0.61, hole 0.305, Top Layer to Bottom Layer, 546 vias
v2: diameter 0.5, hole 0.3, Top Layer to Bottom Layer, 1 via

## Routing (per net, layer and track width the routed paths; a pad name or vN(x,y) marks a point on that pad's centre or on a via; arc(x,y) is an arc through that point)
+3.3V: length 85
  Top Layer w0.6: 113.59,33.08 115.06,31.6 116.25,31.6 117.35,32.7 117.35,32.74 121.32,32.74 121.89,33.31 ; 113.59,33.08 H1.2 115.32,49 v1(115.32,67.03) ; 113.59,33.08 112.92,33.08 111.9,32.05 111.9,30.42 111.58,30.11 FlashPort2.1 ; U30.2 104.12,87.47 v1(106.23,87.47)
  Bottom Layer w0.6: 114.59,85.58 108.9,85.58 108.9,85.94 108.22,86.62 107.65,86.62 106.8,87.47 v1(106.23,87.47) ; 114.59,85.58 U29.5 ; 114.59,85.58 114.15,85.15 114.15,83.75 114.18,83.72 114.18,81.23 115.04,80.37 117.59,80.37 118.02,79.95 118.02,79.25 C1.1 C16.1 117.78,75.49 R6.2 117.78,69.92 C17.1 117.72,69.43 v1(115.32,67.03)
+3.3V_R: length 96
  Top Layer w0.35: U76.2 149.2,32.76 U77.2 150.06,30.76 FlashPort1.1 150.7,30.4 151.2,29.9 157.63,29.9 v1(158.38,30.65) ; v1(147.13,87.84) U48.2 147.5,87.59 148.62,87.59 149.31,86.89 153.13,86.89 153.38,87.14 v1(153.38,87.15)
  Bottom Layer w0.254: U78.5 153.53,87.15 v1(153.38,87.15)
  Bottom Layer w0.35: v1(158.38,30.65) 158.38,32.7 C27.1 C26.1 C35.1 ; v1(147.13,87.84) 147.13,87.59 147.51,87.21 147.51,86.93 146.82,86.24 146.82,85.99 146.78,85.96 146.78,72.21 146.53,71.96 146.53,70.84 146.88,70.5 146.88,67.73 146.76,67.61 146.76,52.76 146.97,52.56 146.97,51.1 147.1,50.97 147.1,50.1 147.51,49.7 147.51,49.17 147.25,48.91 147.25,48.39 147.51,48.13 147.51,44.87 147.34,44.7 147.08,44.7 146.57,44.19 146.57,43.13 147.51,42.2 147.51,41.17 147,40.66 147,40.14 147.22,39.91 147.22,37.48 147.51,37.2 147.51,35.85 151.08,32.27 151.08,31.78 FlashPort1.1
GND: length 426.6
  Top Layer w0.254: L24.2 94.88,44.11 94.88,44.24 94.87,44.24 v1(94.87,46.01) ; v1(73.27,79.54) 72.74,80.07 71.6,80.07 NOREF#24.1 ; L25.2 86.92,28.4 88.06,27.27 v1(88.06,26.7) ; v1(44.32,80.07) 44.84,79.55 L9.2 46.34,78.95 46.81,78.48 53.84,78.48 54.31,78.95 54.54,78.95 v1(56.82,81.23) ; L28.2 123.67,29.93 v1(117.02,23.29) 117.02,22.39 L27.2 ; v1(95.44,63.05) 94.89,62.5 94.88,60.61 L18.2 ; v1(61.36,47.71) 61.36,47.05 L22.2 61.29,46.85 60.61,46.18 60.61,45.61 60.77,45.45 74.42,45.45 v1(74.99,44.87) ; v1(92.91,63.08) 93.28,62.71 93.28,62.62 92.67,62.01 92.41,62.01 92.31,61.91 80.93,61.91 80.91,61.9 80.43,61.9 80.09,62.24 80.09,63.63 v1(78.97,64.75) 78.97,62.76 L17.2 ; U48.41 v1(153.1,82.79) U48.41 ; L12.2 95.31,77.38 94.87,77.82 ; v1(48.87,43.7) 43.74,43.7 43.54,43.9 43.54,44.47 44.32,45.25 v1(44.32,45.44) 44.22,45.34 44.22,45.27 ; v1(61.36,81.81) 61.48,81.69 61.48,80.71 60.8,80.03 60.8,79.46 60.96,79.3 63.01,79.3 63.35,78.95 68.41,78.95 68.88,79.43 69.74,79.43 70.22,78.95 74.35,78.95 v1(74.99,79.6) ; NOREF#7.9 96.59,92.57 96.01,92.57 95.93,92.48 95.59,92.48 95.11,92 94.63,92 94.29,92.34 94.29,92.83 94.32,92.86 94.32,93.15 95.18,94.01 L6.2 95.41,94.24 95.54,94.37 v2(96.49,94.37) ; v1(11.38,58.51) 10.8,58.51 10.65,58.36 ; v1(27.85,74.98) 27.85,75.01 L8.2 27.85,75.37 v1(27.85,76.7) ; v1(13.65,38.06) 12.4,39.3 v1(11.38,39.3) ; v1(10.81,41.03) 10.81,41.13 10.65,41.29 ; v1(40.91,45.44) 37.5,42.03 35.57,42.03 34.98,41.45 29.88,41.45 29.29,42.03 v1(28.42,42.03) 28.04,42.03 L20.2 ; U48.41 U48.41 U48.41 ; L7.2 24.19,75.29 25.59,76.7 v1(26.14,76.7) ; L14.2 v1(28.42,58.36) ; v1(14.22,42.03) 14.78,42.6 22.48,42.6 24.77,44.89 25.25,44.89 25.59,44.55 25.59,43.19 v1(24.44,42.03) ; v1(92.03,78.95) 80.36,78.95 80.35,78.94 79.86,78.94 79.85,78.95 v1(78.4,78.95) 78.38,78.98 L11.2 ; v1(98.28,24.43) 98.18,24.52 L26.2 90.4,25.49 v1(90.33,25.56) ; v1(57.95,64.19) 55.88,62.11 46.48,62.11 46.27,61.9 45.78,61.9 45.57,62.11 L15.2 44.91,62.18 v1(44.91,63.03) ; 78.36,45.27 78.4,45.31 v1(78.4,45.44) 79.28,45.44 79.86,44.86 81.22,44.86 81.24,44.87 91.46,44.87 v1(92.6,46.01) ; v1(154.5,82.79) v1(155.9,82.79) ; v1(155.9,82.79) U48.41 ; v1(155.9,82.79) U48.41 ; U48.41 U48.41 ; L16.2 61.93,64.69 v1(61.93,64.74) 62.25,64.74 63.39,63.6 63.87,63.6 65.01,64.74 75.54,64.74 v1(75.56,64.75) ; v1(32.39,73.27) v1(27.85,73.27)
  Top Layer w0.6: U30.41 U30.41 ; U30.41 U30.41 U30.41 U30.41 ; U30.41 U30.41 ; 112.48,81.23 112.57,81.31 U30.41 U30.41 111.17,81.4 ; 111.26,81.31 111.34,81.23
  Bottom Layer w0.254: v1(56.82,81.23) 57.4,81.81 v1(61.36,81.81) ; v1(74.99,79.6) 77.75,79.6 v1(78.4,78.95) ; v1(117.02,23.29) 115.89,24.43 v1(98.28,24.43) ; v1(26.14,76.7) v1(27.85,76.7) ; v1(10.81,41.03) 13.21,41.03 v1(14.22,42.03) ; v1(27.85,73.27) v1(27.85,74.98) ; v1(24.44,42.03) 24.47,42 28.38,42 v1(28.42,42.03) ; NOREF#15.6 11.52,41.61 10.57,41.61 10.22,41.27 10.22,40.79 10.81,40.2 10.81,39.87 v1(11.38,39.3) ; v1(74.99,44.87) 77.83,44.87 v1(78.4,45.44) ; v1(94.99,77.82) 94.3,78.5 94.3,78.95 v1(92.03,78.95) ; v1(95.44,63.05) 92.94,63.05 v1(92.91,63.08) ; NOREF#25.3 72.12,78.39 v1(73.27,79.54) ; v1(57.95,64.19) 58.5,64.74 v1(61.93,64.74) ; v1(61.36,47.71) 57.95,44.31 57.63,44.31 57.46,44.14 57.22,44.14 56.78,43.7 v1(48.87,43.7) ; v1(92.6,46.01) v1(94.87,46.01) ; v1(88.06,26.7) 89.19,25.56 v1(90.33,25.56) ; v1(44.32,80.07) 39.19,80.07 v1(32.39,73.27) ; v1(75.56,64.75) v1(78.97,64.75) ; v1(11.38,58.51) 14.78,58.51 15.35,57.94 15.4,57.94 15.91,57.43 17.05,57.43 17.98,58.36 v1(28.42,58.36) 28.58,58.36 29.31,59.09 31.12,59.09 32.22,57.99 32.22,57.59 32.38,57.43 34.6,57.43 34.66,57.37 34.92,57.37 40.58,63.03 v1(44.91,63.03) ; v1(40.91,45.44) v1(44.32,45.44)
  Bottom Layer w0.6: 32.01,96.38 USB-C1.A12
  vias: v1(1.67,52.27) v1(2.82,56.78) v1(4.6,77.92) v1(6.15,88.62) v1(11.85,77.06) v1(13.1,67.56) v1(16.49,37.49) v1(18.18,85.76) v1(18.22,44.29) v1(18.3,77.83) v1(18.27,72.68) v1(18.24,38.65) v1(22.17,36.92) v1(24.44,39.19) v1(27.28,42.59) v1(27.85,39.19) v1(32.95,76.65) v1(32.94,49.93) v1(34.69,42.47) v1(35.2,89.19) v1(35.16,71.93) v1(35.23,59.07) v1(35.9,64.99) v1(36.92,93.73) v1(36.94,60.78) v1(38.54,77.24) v1(38.64,62.48) v1(38.67,56.43) v1(40.91,42.6) v1(42.05,86.34) v1(47.16,41.47) v1(47.73,79.52) v1(48.93,71.02) v1(50,80.09) v1(50,42.03) v1(50.54,58.02) v1(50.57,46.01) v1(52.2,91.49) v1(52.26,72.67) v1(52.84,50.54) v1(53.4,79.48) v1(53.33,76.54) v1(53.98,46.01) v1(54.54,31.81) v1(55.7,42.01) v1(56.23,74.93) v1(56.82,31.81) v1(57.95,46.58) v1(59.09,31.81) v1(61.23,83.38) v1(61.36,31.81) v1(61.5,97.71) v1(63.63,31.81) v1(63.99,60.81) v1(64.22,77.87) v1(67.69,94.85) v1(68.74,87.47) v1(69.3,57.4) v1(69.27,48.24) v1(69.34,65.9) v1(71.58,88.04) v1(72.74,72.07) v1(72.73,43.21) v1(73.29,90.31) v1(73.86,78.37) v1(76.7,35.22) v1(78.36,95.91) v1(78.97,80.09) v1(81.82,75) v1(81.75,40.9) v1(82.42,57.34) v1(82.44,92.57) v1(85.74,72.6) v1(85.81,63.14) v1(86.32,57.42) v1(86.29,46.41) v1(86.34,52.3) v1(86.37,39.75) v1(86.63,80.05) v1(86.65,91.28) v1(87.47,76.22) v1(89.79,76.17) v1(90.36,90.32) v1(91.54,63.05) v1(91.72,85.8) v1(97.7,74.41) v1(98.28,86.41) v1(99.74,84.25) v1(101.12,63.63) v1(102.84,27.83) v1(103.39,69.3) v1(103.94,59.62) v1(105.17,69.3) v1(105.71,65.94) v1(105.66,63.62) v1(106.8,76.68) v1(107.37,57.94) v1(107.94,84.07) v1(107.94,79.52) v1(108.15,22.97) v1(110.21,58.51) v1(111.34,68.16) v1(111.91,76.68) v1(111.91,73.84) v1(112.48,84.63) v1(115.16,84.25) v1(115.7,33.69) v1(117.02,66.46) v1(117.72,81.79) v1(117.76,85.2) v1(118.16,88.61) v1(118.38,31.4) v1(119.3,86.91) v1(119.74,77.82) v1(120.47,34.63) v1(121.76,67.53) v1(121.76,64.12) v1(123.27,28.4) v1(124.41,26.13) v1(145.88,36.65) v1(147.88,48.65) v1(148.38,45.9) v1(148.88,39.15) v1(149.13,78.32) v1(149.07,31.41) v1(149.88,79.9) v1(151.13,86.15) v1(151.13,47.9) v1(151.13,47.15) v1(151.13,46.4) v1(151.38,43.9) v1(152.63,74.57) v1(152.63,73.23) v1(152.63,51.4) v1(153.13,44.4) v1(153.63,84.4) v1(154.38,64.15) v1(154.63,76.9) v1(154.63,49.15) v1(154.88,39.15) v1(157.13,89.65) v1(157.13,49.4) v1(157.38,74.9) v1(157.63,36.9) v1(157.88,64.9) v1(158.55,72.65) v1(158.63,64.15) v1(158.88,82.65) v1(159.63,87.4) v1(159.88,72.65) v1(160.63,41.51) v1(160.63,39.4) v1(160.63,36.66) v1(160.88,80.15) v1(160.88,24.4) v1(161.13,78.4) v1(161.38,61.65) v1(162.13,76.9) v1(163.13,68.57) v1(164.13,39.4) v1(164.63,55.9) v1(164.76,63.15) v1(165.63,24.4) v1(167.13,74.65) v1(167.13,69.65) v1(167.35,72.4) v1(167.63,28.15) v1(168.13,55.9) v1(168.63,87.65) v1(169.63,75.15) v1(169.88,70.65) v1(169.87,58.27) v1(170.63,46.4) v1(172.38,82.65) v1(173.57,43.55) v1(175.71,24.8) v1(176.13,45.65) v1(176.88,61.15) v1(177.15,71.77) v1(177.63,54.15) v1(179.38,24.65) v1(180.13,72.15) v1(182.01,65.4) v1(182.13,62.9) v1(182.88,92.65) v1(183.13,75.9) v1(183.13,42.39) v1(183.63,72.9) v1(185.63,56.15) v1(185.88,77.15) v1(186.13,72.65) v1(186.13,24.65) v1(187.38,76.9) v1(189.73,50.95) v1(190.13,83.65) v1(193.63,81.15) v1(193.63,44) v1(194.38,73.15) v1(194.63,63.65) v1(194.59,56.77) v1(194.88,96.4) v1(196.88,91.9) v1(197.02,73.65) v1(198.88,64.15) v1(200.38,96.4) v1(200.63,78.4) v1(202.13,79.15) v1(202.13,62.15) v1(202.13,50.15) v1(202.63,96.15) v1(202.63,92.15) v1(202.88,74.4) v1(203.38,58.4) v1(204.71,67.27) v1(210.13,96.65) v1(210.13,45.65) v1(210.15,82.65) v1(210.88,76.65) v1(210.88,47.4) v1(211.88,64.23) v1(211.88,58.15) v1(212.38,96.4) v1(213.65,90.52) v1(215.63,58.15) v1(215.82,75.52) v1(216.77,59.62) v1(218.88,49.15) v1(220.38,74.4) v1(225.63,81.4) v1(227.88,63.65) v1(230.13,48.4) v1(231.13,91.65) v1(232.13,76.4) v1(232.58,86.77) v1(232.88,55.4) v1(233.63,93.65) v1(236.63,85.15) v1(236.97,55.52) v1(237.18,69.9) v1(238.38,88.4) v1(240.75,81.49) v1(241.88,77.9) v1(242.13,44.15) v1(247.86,86.77) v1(248.38,70.65) v1(249.88,53.4) v1(249.88,35.4) v1(253.88,54.65) v1(253.9,53.02) v1(253.88,51.4) v1(255.13,44.65)
VBUS: length 683
  Top Layer w0.254: v1(99.47,91.45) 99.18,91.45 98.14,92.49 97.24,92.49 v1(96.58,93.15) ; 67.06,27.29 L25.4 ; 59.36,62.09 59.26,62.09 v1(59.09,61.91) ; 7.47,41.67 7.27,41.47 ; L5.4 76.18,94.91 v1(76.13,94.86)
  Top Layer w0.6: 8.15,57.3 8.66,57.3 L13.4 ; 8.15,57.3 7.98,57.46 7.98,57.79 7.87,57.9 7.87,58.81 7.98,58.93 7.98,66.33 6.21,68.11 6.21,73.02 7.22,74.03 7.22,74.41 ; 8.15,57.3 7.58,57.3 5.13,54.85 5.13,51.69 8.15,48.66 8.15,42.35 7.47,41.67 7.47,40.91 7.64,40.74 7.7,40.74 8.15,40.29 L19.4 ; L28.4 128.32,28.57 127.81,29.08 125.09,29.08 v1(124.98,28.97) ; 22.01,90.31 24.92,90.31 L2.4 25.82,91.11 26.56,91.85 26.56,91.96 26.79,92.19 26.79,92.56 27.36,93.13 27.36,93.64 ; 22.01,90.31 22.58,89.75 22.58,86.85 23.71,85.72 23.71,85.15 25.51,83.35 25.72,83.35 26.98,82.09 26.98,81.74 26.93,81.69 26.93,79.66 26.98,79.61 26.98,75.82 26.82,75.65 26.82,74.84 26.17,74.19 L8.4 25.58,74.04 25.33,74.04 25.07,73.78 24.83,73.78 24.48,73.44 24.03,73.44 22.17,71.57 22.17,69.3 25.79,65.68 25.79,60 26.71,59.07 26.71,58.42 26.64,58.35 26.64,57.49 25.93,57.49 25.79,57.36 25.79,56.04 23.71,53.96 23.71,53.72 23.3,53.31 23.3,52.06 23.71,51.66 23.71,51.41 25.51,49.61 25.76,49.61 26.32,49.05 26.32,42.19 26.49,42.02 26.49,41.31 25.88,40.7 25.77,40.7 L20.4 ; 22.01,90.31 15.08,90.31 ; 115.52,23.48 115.86,23.15 115.86,22.66 115.34,22.14 114.51,22.14 L27.4 ; 115.52,23.48 115.52,23.49 v1(118.73,26.7) ; 115.52,23.48 114.91,24.1 112.39,24.1 110.93,25.56 v1(101.12,25.56) ; 59.36,48.28 60.21,47.43 60.21,46.56 59.66,46.01 ; 59.36,48.28 59.36,55.43 57.75,57.03 57.75,59.58 59.36,61.19 L16.4 59.64,63.33 59.75,63.33 60.21,63.79 60.21,64.5 59.55,65.17 59.55,72.11 57.75,73.9 57.75,76.45 59.55,78.24 59.55,79.83 59.65,79.83 60.4,80.57 60.4,81.29 59.93,81.76 59.93,88.52 59.53,88.92 59.31,88.92 57.51,90.72 57.51,90.94 57.39,91.06 57.39,93.47 59.27,95.36 59.27,96.45 L4.4 ; 59.36,48.28 58.79,47.71 v1(56.82,47.71) ; 27.36,93.64 27.36,94.16 26.91,94.61 USB-C1.A4 ; 27.36,93.64 27.45,93.74 v1(30.12,93.74) ; L5.4 76.39,94.87 76.39,93.06 74.78,91.45 74.78,88.9 77.24,86.44 77.24,78.72 76.77,78.26 76.67,78.26 L11.4 76.39,76.19 74.78,74.58 74.78,72.03 76.39,70.42 76.39,62.81 76.39,62.81 76.95,62.81 77.21,62.54 77.21,61.83 76.75,61.37 76.64,61.37 L17.4 76.43,61.02 76.43,59.36 74.78,57.71 74.78,55.16 77.28,52.66 77.28,45.01 76.81,44.55 76.71,44.55 76.43,44.27 78.06,42.64 79.13,42.64 79.21,42.56 L24.4 ; 26.98,96.28 26.98,96.61 27.44,97.06 28.22,97.06 30.56,99.4 v1(31.26,99.4) ; L22.4 60.82,44.52 62.11,44.52 67.92,38.71 67.92,28.15 67.45,27.69 67.34,27.69 L25.4 ; v1(93.74,93.17) 93.74,91.51 91.8,89.58 91.8,87.03 93.48,85.35 93.48,78.35 94.23,77.6 94.23,76.89 93.77,76.43 93.66,76.43 L12.4 93.5,76.03 93.5,74.4 91.8,72.7 91.8,70.16 94.35,67.61 94.35,59.81 93.88,59.34 93.78,59.34 L18.4 ; 89.44,29.23 89.44,24.78 88.93,24.26 88.48,24.26 L26.4 ; 89.44,29.23 83.25,29.23 v1(81.81,30.67) ; 89.44,29.23 89.44,30.55 ; L24.4 93.78,42.84 93.88,42.84 94.35,43.31 94.35,44.02 93.5,44.87 93.5,51.59 91.8,53.29 91.8,55.83 93.5,57.53 L18.4 ; L24.4 88.28,37.35 88.28,34.26 88.03,34 88.03,31.97 89.44,30.55 ; L18.4 92.04,59.06 90.9,60.21 v1(89.19,60.21) ; 15.08,90.31 14.52,89.75 14.52,86.62 6.65,78.76 6.65,74.59 6.83,74.41 7.22,74.41 ; 15.08,90.31 13.65,90.31 13.48,90.48 v1(13.48,90.88) ; 7.22,74.41 7.22,74.48 ; 7.22,74.41 8.21,74.41 8.33,74.29 L7.4 ; v1(39.78,96.56) 43.24,96.56 43.73,96.07 43.73,95.59 ; v1(10.81,73.27) 13.65,73.27 v1(14.78,72.14) ; 31.16,96.28 v1(31.16,95.61) 31.16,94.94 ; 89.44,30.55 89.46,30.54 91.49,30.54 91.51,30.55 93.29,30.55 v1(97.71,26.13) ; 43.73,95.59 43.73,94.92 40.34,91.52 40.34,89.54 40.73,89.15 40.73,88.9 42.53,87.1 42.78,87.1 43.02,86.86 43.02,80.15 43.76,79.41 43.76,78.7 43.02,77.95 L9.4 42.91,77.38 41.3,75.77 41.3,75.15 40.73,74.58 40.73,72.03 42.53,70.23 43.1,70.23 43.91,69.42 44.16,69.42 44.16,68.77 43.96,68.57 43.96,66.54 44.16,66.34 44.16,62.73 43.99,62.56 43.99,61.76 43.34,61.11 42.89,61.11 42.29,60.51 42.29,59.27 40.73,57.71 40.73,55.16 42.53,53.36 42.8,53.36 42.97,53.19 42.97,45.9 43.14,45.73 43.14,45.01 42.55,44.43 42.45,44.43 42.29,44.27 ; 7.27,41.47 v1(6.26,41.47) ; v1(37.5,99.97) 68.31,99.97 68.84,100.5 70.75,98.93 arc(70.93,98.83) 71.13,98.79 85.37,98.79 87.64,96.51 101.61,96.51 102.07,96.05 102.07,93.41 102.29,93.18 102.29,89.78 101.69,89.18 v1(101.69,88.61)
  Bottom Layer w0.254: v1(96.58,93.15) 95.13,93.15 95.11,93.17 v1(93.74,93.17) ; v1(99.47,91.45) 101.69,89.23 v1(101.69,88.61) ; C22.1 55.7,61.35 56.43,62.07 57.46,62.07 58.19,61.35 58.52,61.35 v1(59.09,61.91)
  Bottom Layer w0.6: C19.2 55.55,45.44 56.25,46.14 56.25,47.15 v1(56.82,47.71) ; C24.2 72.18,94.44 72.18,94.53 72.83,95.19 73.08,95.19 73.31,95.43 73.53,95.43 73.76,95.19 75.79,95.19 v1(76.13,94.86) ; 32.96,97.7 31.82,97.7 31.16,97.03 31.16,96.28 ; 32.96,97.7 34.1,97.7 36.37,99.97 v1(37.5,99.97) 37.5,98.83 v1(39.78,96.56) ; 32.96,97.7 v1(31.26,99.4) ; D28.2 13.69,90.68 v1(13.48,90.88) ; v1(89.19,60.21) 89.19,58.64 C21.1 ; C20.2 5.54,39.74 5.54,39.83 5.81,40.1 5.9,40.1 6.26,40.46 v1(6.26,41.47) ; CN1.4 124.98,32.12 v1(124.98,28.97) NOREF#28.8 v1(118.73,26.7) ; v1(81.81,30.67) 81.01,29.87 80.22,29.87 79.4,29.06 C18.1 69.88,28.97 68.18,27.27 v1(67.04,27.27) ; v1(101.12,25.56) 98.28,25.56 v1(97.71,26.13) ; v1(10.81,73.27) 10.24,73.27 v1(9.1,74.41) ; v1(101.69,88.61) 115.3,88.61 U29.1 117.57,85.96 117.02,85.96 116.75,85.7 116.75,84.7 117.02,84.44 117.57,84.44 U29.3 ; v1(30.12,93.74) 30.21,93.74 31.08,94.61 31.08,95.53 v1(31.16,95.61) ; v1(14.78,72.14) C23.2
VBUS_R: length 582.5
  Top Layer w0.254: v1(249.88,39.4) 249.88,39.46 249.95,39.54 ; v1(214.38,61.4) 214.31,61.47
  Top Layer w0.6: 205.69,96.87 207.09,95.48 208.54,95.48 208.6,95.42 222.34,95.42 222.55,95.21 L32.4 222.92,95.09 223.31,95.09 223.97,94.43 229.34,94.43 229.57,94.66 230.87,94.66 233.51,92.02 238.25,92.02 238.94,91.34 239.55,91.34 L33.4 239.92,91.22 240.3,91.22 ; 205.69,96.87 L31.4 ; 205.69,96.87 204.07,95.25 198.48,95.25 197.88,94.65 191.19,94.65 191.09,94.55 189.91,94.55 189.21,95.25 L30.4 188.07,95.25 183.97,91.15 ; 150.49,22.36 150.59,22.46 152.43,22.46 153.31,23.34 175.16,23.34 175.46,23.04 190.39,23.04 ; v1(170.28,62.9) 171.38,62.9 v1(172.13,62.15) 171.25,61.27 171.02,61.27 170.75,61.01 170.75,60.1 171.02,59.83 171.32,59.83 L41.4 ; 198.36,43.2 201.54,43.2 202.9,44.57 203.71,44.57 205.65,46.5 206.29,46.5 207.94,44.85 222.32,44.85 L50.4 ; 198.36,43.2 190.78,43.2 189.42,44.57 L48.4 186.97,42.76 185.91,42.76 184.36,41.22 173.82,41.22 172.28,42.76 L47.4 171.36,43.04 171.06,43.04 170.79,43.31 170.79,44.21 ; 198.36,43.2 198.11,42.95 198.11,31.88 v1(196.63,30.4) ; v1(175.38,62.4) 175.88,62.9 v1(180.38,62.9) ; L41.4 171.6,57.6 170.18,56.17 170.18,53.62 171.6,52.2 171.6,45.03 170.79,44.21 ; L41.4 172.24,59.55 172.95,58.85 173.51,58.85 174.08,58.27 185.47,58.27 L42.4 189.27,61.44 189.98,60.73 195.22,60.73 195.68,60.27 202.51,60.27 L43.4 207.16,61.73 208.54,61.73 208.8,61.47 L44.4 223.36,61.47 224.54,60.29 231.49,60.29 233.79,57.99 239.45,57.99 L45.4 240.37,57.71 241.61,56.47 248.43,56.47 248.63,56.67 v1(255.55,56.67) L46.4 ; 170.79,44.21 170.11,44.9 v1(161.63,44.9) ; v1(256.63,79.9) 256.88,79.65 256.88,76.75 257.67,75.97 257.67,75.4 257.31,75.04 257.3,75.04 256.85,74.58 L40.4 256.49,74.58 255.37,73.46 241.44,73.46 240.32,74.58 L39.4 229.45,74.58 v1(227.63,76.4) ; 190.39,23.04 193.27,23.04 v1(197.88,27.65) 197.89,27.65 L55.4 ; 190.39,23.04 v1(190.39,22.65) ; 240.42,94.42 238.25,94.42 237.79,94.87 237.79,95.12 USB-C2.A4 237.72,95.2 USB-C2.B9 ; 240.42,94.42 241.44,94.42 241.9,94.87 241.9,95.12 USB-C2.A9 241.97,95.2 USB-C2.B4 ; 240.42,94.42 240.42,93.03 240.52,92.92 240.52,92.21 240.42,92.11 240.42,91.33 240.3,91.22 ; 183.97,91.15 175.36,91.15 174.46,92.05 172.05,92.05 171.15,91.15 168.88,91.15 v1(168.38,90.65) ; 183.97,91.15 181.83,89.01 C33.2 ; v1(166.12,90.14) 166.35,90.37 166.35,90.62 167.63,91.9 v1(167.63,92.15) ; v1(255.38,90.65) 255.93,90.65 256.5,91.22 ; 240.3,91.22 240.87,90.65 249.13,90.65 249.7,91.22 256.5,91.22 ; v1(150.94,45.4) 155.88,45.4 v1(156.38,44.9) ; 171.59,76.45 172.41,75.63 v1(179.67,75.63) 182.47,78.43 188.8,78.43 189.05,78.18 189.44,78.18 189.97,77.65 193.55,77.65 194.02,77.18 202.7,77.18 L37.4 206.93,78.96 221.73,78.96 222.33,78.36 L38.4 222.86,78.15 v1(223.13,78.15) ; L51.4 240.27,40.82 240.97,40.12 245.21,40.12 245.79,39.54 254.91,39.54 256.19,40.82 256.5,40.82 L52.4 ; 256.5,91.22 256.7,91.42 ; v1(181.24,64.98) 181.24,66.79 v1(179.88,68.15)
  Bottom Layer w0.254: C29.2 v1(170.28,62.9) ; v1(167.63,92.15) D56.2
  Bottom Layer w0.6: v1(214.38,61.4) 214.38,59.7 C32.1 ; 150.94,36.78 150.94,43.27 150.62,43.59 150.62,44.21 150.83,44.42 150.83,44.45 150.94,44.55 v1(150.94,45.4) ; v1(156.38,44.9) v1(161.63,44.9) ; U78.3 157.18,85.2 157.54,85.56 157.85,85.56 158.01,85.72 158.01,86.58 157.85,86.74 157.54,86.74 157.18,87.1 U78.1 ; v1(255.13,39.65) 255.78,40.3 256.38,40.3 256.38,40.9 256.33,40.95 256.33,49.34 255.2,50.47 255.2,54.3 255.55,54.65 v1(255.55,56.67) 255.77,56.9 C30.2 ; v1(255.38,90.65) 255.63,90.4 255.63,88.48 255.2,88.05 255.2,85.5 255.38,85.32 255.38,84.05 256.41,83.02 256.41,80.37 256.63,80.15 v1(256.63,79.9) ; C28.1 v1(249.88,39.4) ; v1(197.88,27.65) 197.88,29.15 v1(196.63,30.4) ; v1(227.63,76.4) 227.63,77.65 227.13,78.15 v1(223.13,78.15) ; v1(175.38,62.4) 172.38,62.4 v1(172.13,62.15) ; v1(179.67,75.63) 179.88,75.42 179.88,72.97 179.37,72.46 179.37,71.84 179.88,71.33 v1(179.88,68.15) ; v1(232.12,93.34) 232.12,91.46 C34.2 ; v1(168.38,90.65) 167.53,91.5 D56.2 ; C31.1 190.39,22.61 v1(190.39,22.65) ; v1(166.12,90.14) 166.17,90.09 166.17,89.19 164.09,87.11 163.46,87.11 162.14,85.79 158.56,85.79 158.18,86.16 ; v1(181.24,64.98) 181.24,63.76 v1(180.38,62.9)
(no net): length 2.1
  Top Layer w0.254: 128.3,29.93 128.3,31.32 127.82,31.81
  vias: v1(206.63,70.4)
LBOOT: length 63.1
  Top Layer w0.254: FlashPort2.4 115.52,28.97 116.32,28.17 118.26,28.17 121.89,31.8 121.89,32.21 127.16,37.48 128.81,37.48 129.75,38.41 129.75,40.87 132.36,43.48 132.36,43.74 131.92,44.17 122.69,49.49 arc(122.53,49.64) 122.47,49.86 122.47,53.62 121.18,54.92 121.18,55.28 121.5,55.6 121.5,59.84 118.36,62.97 SW2.2 120.43,66.18 120.43,69.3 121.42,70.28 U30.27
LC0: length 173.2
  Top Layer w0.254: U30.8 105.62,80.05 v1(105.66,80.09) ; v1(71.02,90.88) 74.14,87.75 74.4,87.75 75.73,86.42 75.73,84.53 75.65,84.45 v1(75.65,82.33) ; v1(14.22,55.67) 13.65,56.23 v1(11.38,56.23)
  Bottom Layer w0.254: v1(105.66,80.09) 105.66,80.5 106.25,81.08 106.25,82.6 103.66,85.19 95.49,85.19 91.62,81.32 89.53,81.32 88.52,82.33 88.16,82.33 87.88,82.05 85.73,82.05 85.44,82.33 81.58,82.33 81.4,82.15 79.51,82.15 79.32,82.33 v1(75.65,82.33) ; v1(14.22,55.67) 16.04,53.84 U13.2 16.04,46.37 14.8,45.14 14.8,41.96 15.52,41.24 15.52,40.55 14.8,39.84 14.8,30.63 U19.2 ; v1(71.02,90.88) 69.01,88.88 61.13,88.88 60.44,88.19 60.44,85.92 57.8,83.29 52.69,83.29 50.78,81.37 38.31,81.37 35.33,78.4 28.44,78.4 26.16,80.68 24.56,80.68 23.33,79.45 18.36,79.45 17.13,80.68 U1.2 14.24,76.04 15.37,74.91 15.37,71.61 14.24,70.48 U7.2 ; U7.2 11.32,59.09 11.13,59.09 10.79,58.75 10.79,58.26 11.38,57.68 v1(11.38,56.23)
LC1: length 167.6
  Top Layer w0.254: v1(61.36,95.99) 71.18,86.18 71.18,84.53 73.35,82.36 v1(73.86,82.36) ; v1(32.96,46.58) 32.96,44.87 v1(30.12,42.03) ; v1(29.55,58.51) 32.96,61.91 v1(32.96,63.62) ; v1(42.05,84.63) 38.07,80.66 v1(32.96,80.66) 32.96,78.39 v1(29.55,74.98) ; v1(105.66,78.95) 104.09,78.95 U30.9
  Bottom Layer w0.254: U8.2 31.26,74.47 31.43,74.63 31.43,75.32 31.26,75.48 30.19,75.48 29.68,74.98 v1(29.55,74.98) ; U8.2 32.96,63.71 v1(32.96,63.62) ; U2.2 32.98,80.68 v1(32.96,80.66) ; v1(61.36,95.99) 53.41,95.99 46.71,89.3 46.71,88.97 45.01,87.27 44.69,87.27 v1(42.05,84.63) ; U14.2 33.06,46.68 v1(32.96,46.58) ; v1(105.66,78.95) 106.25,79.54 106.25,80.16 106.69,80.6 106.69,80.85 106.82,80.98 106.82,81.46 107.04,81.68 107.04,81.94 107.17,82.07 107.17,83.89 103.03,88.03 101.45,88.03 101.1,88.37 101.1,88.85 98.89,91.07 98.89,91.69 99.41,92.21 99.41,93.21 98.39,94.23 97.17,94.23 96.78,93.84 86.34,93.84 80.33,87.84 79.95,87.84 75.75,83.65 75.75,83.51 75.41,83.17 75.41,82.92 75.04,82.54 74.04,82.54 v1(73.86,82.36) ; U14.2 31.26,57.43 31.43,57.59 31.43,58.28 31.26,58.44 30.19,58.44 30.02,58.28 29.78,58.28 v1(29.55,58.51) ; U20.2 33.06,40.18 31.83,41.4 30.75,41.4 v1(30.12,42.03)
LC2: length 146.7
  Top Layer w0.254: v1(50,67.59) 50,66.46 v1(46.02,62.48) ; v1(97.14,76.68) 94.86,78.97 94.86,79.76 95.2,80.11 98.52,80.11 99.43,79.2 99.43,78.71 99.2,78.48 99.2,74.04 v1(99.4,73.84) ; v1(46.02,45.44) 50,49.42 v1(50,50.55) ; v1(90.9,73.27) 91.15,73.27 92.62,74.74 92.62,75.22 90.59,77.25 v1(78.4,77.25) ; v1(58.52,81.23) 58.4,81.34 58.4,81.51 58.52,81.63 58.52,81.79 56.25,84.07 v1(50,84.07) 50,82.93 v1(46.59,79.52) ; v1(103.96,77.25) 103.96,77.47 U30.10
  Bottom Layer w0.254: U3.2 50,84.34 v1(50,84.07) ; v1(103.96,77.25) 103.17,77.25 102.84,76.92 102.84,76.44 100.81,74.41 99.97,74.41 v1(99.4,73.84) ; v1(46.02,62.48) 46.25,62.26 47.06,62.26 47.23,62.42 48.3,62.42 48.47,62.26 48.47,61.57 48.28,61.39 U15.2 ; U21.2 48.28,44.35 48.47,44.53 48.47,45.22 48.3,45.38 47.23,45.38 47.06,45.22 46.25,45.22 v1(46.02,45.44) ; v1(50,67.59) 50.05,67.59 U9.2 50.08,77.11 48.3,78.89 47.22,78.89 v1(46.59,79.52) ; U15.2 50,50.6 v1(50,50.55) ; v1(90.9,73.27) 90.9,74.98 91.45,75.53 91.71,75.53 92.05,75.87 92.42,75.87 93.02,76.47 95.49,76.47 95.7,76.68 95.75,76.68 95.77,76.7 96.25,76.7 96.27,76.68 v1(97.14,76.68) ; v1(58.52,81.23) 59.09,80.66 61.67,80.66 61.91,80.9 61.91,81.54 61.94,81.57 61.94,82.07 62.25,82.38 65.2,82.38 65.86,81.72 65.86,80.17 65.73,80.03 65.73,79.75 65.9,79.58 67.9,79.58 68.31,79.99 69.74,79.99 70.15,79.58 71.78,79.58 72.5,80.3 73.9,80.3 73.91,80.29 73.91,79.84 74.17,79.58 74.18,79.58 74.75,79.01 75.5,79.01 76.7,77.82 77.83,77.82 v1(78.4,77.25)
LC3: length 117.7
  Top Layer w0.254: v1(63.06,81.23) 67.04,85.2 67.04,85.77 v1(66.47,86.34) ; v1(63.63,64.19) 67.04,67.59 v1(67.04,69.3) ; U30.11 103.38,75.7 103.05,75.7 102.89,75.54 102.89,75.21 102.65,74.98 v1(102.26,74.98) ; v1(93.17,67.03) 93.17,68.04 91.27,69.94 91.27,71.76 v1(90.9,72.14) ; v1(67.04,52.83) 67.04,51.12 v1(63.06,47.15)
  Bottom Layer w0.254: 65.31,35.69 65.31,46.03 65.51,46.23 65.51,46.92 65.34,47.08 64.27,47.08 64.1,46.92 63.29,46.92 v1(63.06,47.15) ; U4.2 66.77,86.34 v1(66.47,86.34) ; 65.31,69.43 65.31,80.11 65.51,80.31 65.51,81 65.34,81.16 64.27,81.16 64.1,81 63.29,81 v1(63.06,81.23) ; v1(102.26,74.98) 101.03,73.75 100.99,73.75 97.78,70.54 97.78,70.23 96.08,68.53 95.8,68.53 94.3,67.03 v1(93.17,67.03) ; v1(67.04,52.83) 67.11,52.76 U16.2 ; v1(90.9,72.14) 89.19,72.14 83.45,77.88 82.94,77.88 82.77,78.04 82.77,78.56 81.22,80.11 79.86,80.11 79.52,79.76 79.52,79.28 78.98,78.74 78.98,77.01 78.64,76.67 75.21,76.67 67.98,69.43 U10.2 67.04,69.36 v1(67.04,69.3) ; 65.31,52.56 65.31,63.07 65.51,63.27 65.51,63.96 65.34,64.12 64.27,64.12 64.1,63.96 63.86,63.96 v1(63.63,64.19)
LC4: length 153.1
  Top Layer w0.254: v1(84.08,50.55) 84.08,49.42 v1(80.1,45.44) ; v1(80.1,79.52) 84.08,83.5 v1(84.08,84.07) ; v1(96.58,61.93) 97.69,63.05 98.57,63.05 98.57,63.05 103.46,63.05 107.36,59.14 111.12,59.14 111.64,59.66 111.64,61.89 111.48,62.06 110.75,62.06 109.62,63.19 109.62,65 109.97,65.34 112.21,65.34 112.24,65.31 112.72,65.31 115.3,67.89 115.3,70.61 U30.23 ; v1(84.08,67.59) 84.08,65.89 v1(80.67,62.48) ; v1(74.99,22.72) 71.02,26.7 67.3,26.7 67.28,26.68 66.8,26.68 66.78,26.7 v1(64.77,26.7)
  Bottom Layer w0.254: U23.2 U23.2 ; U23.2 82.33,44.31 82.55,44.53 82.55,45.22 82.38,45.38 81.31,45.38 81.14,45.22 80.33,45.22 v1(80.1,45.44) ; U23.2 75.63,33.81 71.94,30.12 66.23,30.12 65.89,29.78 65.89,29.3 66.23,28.95 66.23,28.16 v1(64.77,26.7) ; v1(96.58,61.93) 88.98,61.93 85.27,65.63 85.27,66.41 U11.2 84.09,67.59 v1(84.08,67.59) 83.7,67.97 83.7,76.06 81.98,77.78 81.98,78.73 81.81,78.9 80.72,78.9 v1(80.1,79.52) ; v1(74.99,22.72) 74.99,17.18 U25.2 ; 84.08,50.63 84.08,59.59 81.82,61.85 81.3,61.85 v1(80.67,62.48) ; 84.08,50.63 v1(84.08,50.55) ; 84.08,50.63 U17.2 ; v1(84.08,84.07) 84.08,84.38 U5.2
LC5: length 106.1
  Top Layer w0.254: v1(98.85,78.95) 98.8,78.91 98.8,69.34 v1(98.85,69.3) ; v1(108.5,63.62) v1(108.5,68.16) ; v1(93.74,14.2) 99.35,19.82 v1(99.35,29.54) ; v1(111.34,69.3) 113.05,67.59 113.62,67.59 113.79,67.77 113.79,70.05 114.03,70.29 114.03,70.61 U30.22 ; v1(99.35,61.91) v1(99.35,51.12) ; v1(99.98,45.44) v1(99.98,34.65)
  Bottom Layer w0.254: 101.15,31.94 99.98,33.11 v1(99.98,34.65) ; U18.2 99.98,48.18 v1(99.98,45.44) ; v1(98.85,69.3) 98.85,67.99 101.15,65.68 ; 101.15,65.68 101.39,65.68 107.45,59.63 108.18,59.63 108.52,59.97 108.52,63.6 v1(108.5,63.62) ; 101.15,65.68 U12.2 v1(99.35,61.91) ; U26.2 93.74,11.86 v1(93.74,14.2) ; v1(99.35,51.12) 101.15,49.32 101.15,48.81 ; U6.2 99.35,79.46 v1(98.85,78.95) ; v1(108.5,68.16) 109.64,69.3 v1(111.34,69.3) ; U24.2 v1(99.35,29.54)
LC6: length 80.3
  Top Layer w0.254: U30.21 113.05,70.9 v1(113.05,68.73)
  Bottom Layer w0.254: v1(113.05,68.73) 111.34,67.03 111.34,58.51 105.66,52.83 105.66,39.19 108.89,35.96 108.89,26.88 109.07,26.7 117.02,26.7 123.27,20.45 123.27,16.04 116.18,8.95
LCND1: length 39.9
  Top Layer w0.254: R14.1 125.57,42.29 124.62,43.25 116.46,51.41 v1(116.46,53.96) ; U30.19 110.76,71.42 v1(110.61,71.57)
  Bottom Layer w0.254: v1(116.46,53.96) 115.32,53.96 113.63,55.65 113.63,68.97 112.72,69.88 111.1,69.88 111.09,69.87 110.78,69.87 110.61,70.03 v1(110.61,71.57)
